# Altium schematic sheet 12_Power.SchDoc: Power (part 1 of 2)
size A3; Organization: Lime Microsystems; Address1: Surrey Tech Centre; Address2: Guildford GU2 7YG; Address3: Surrey; Address4: United Kingdom; Revision: v1.1; SheetNumber: 12; SheetTotal: 12
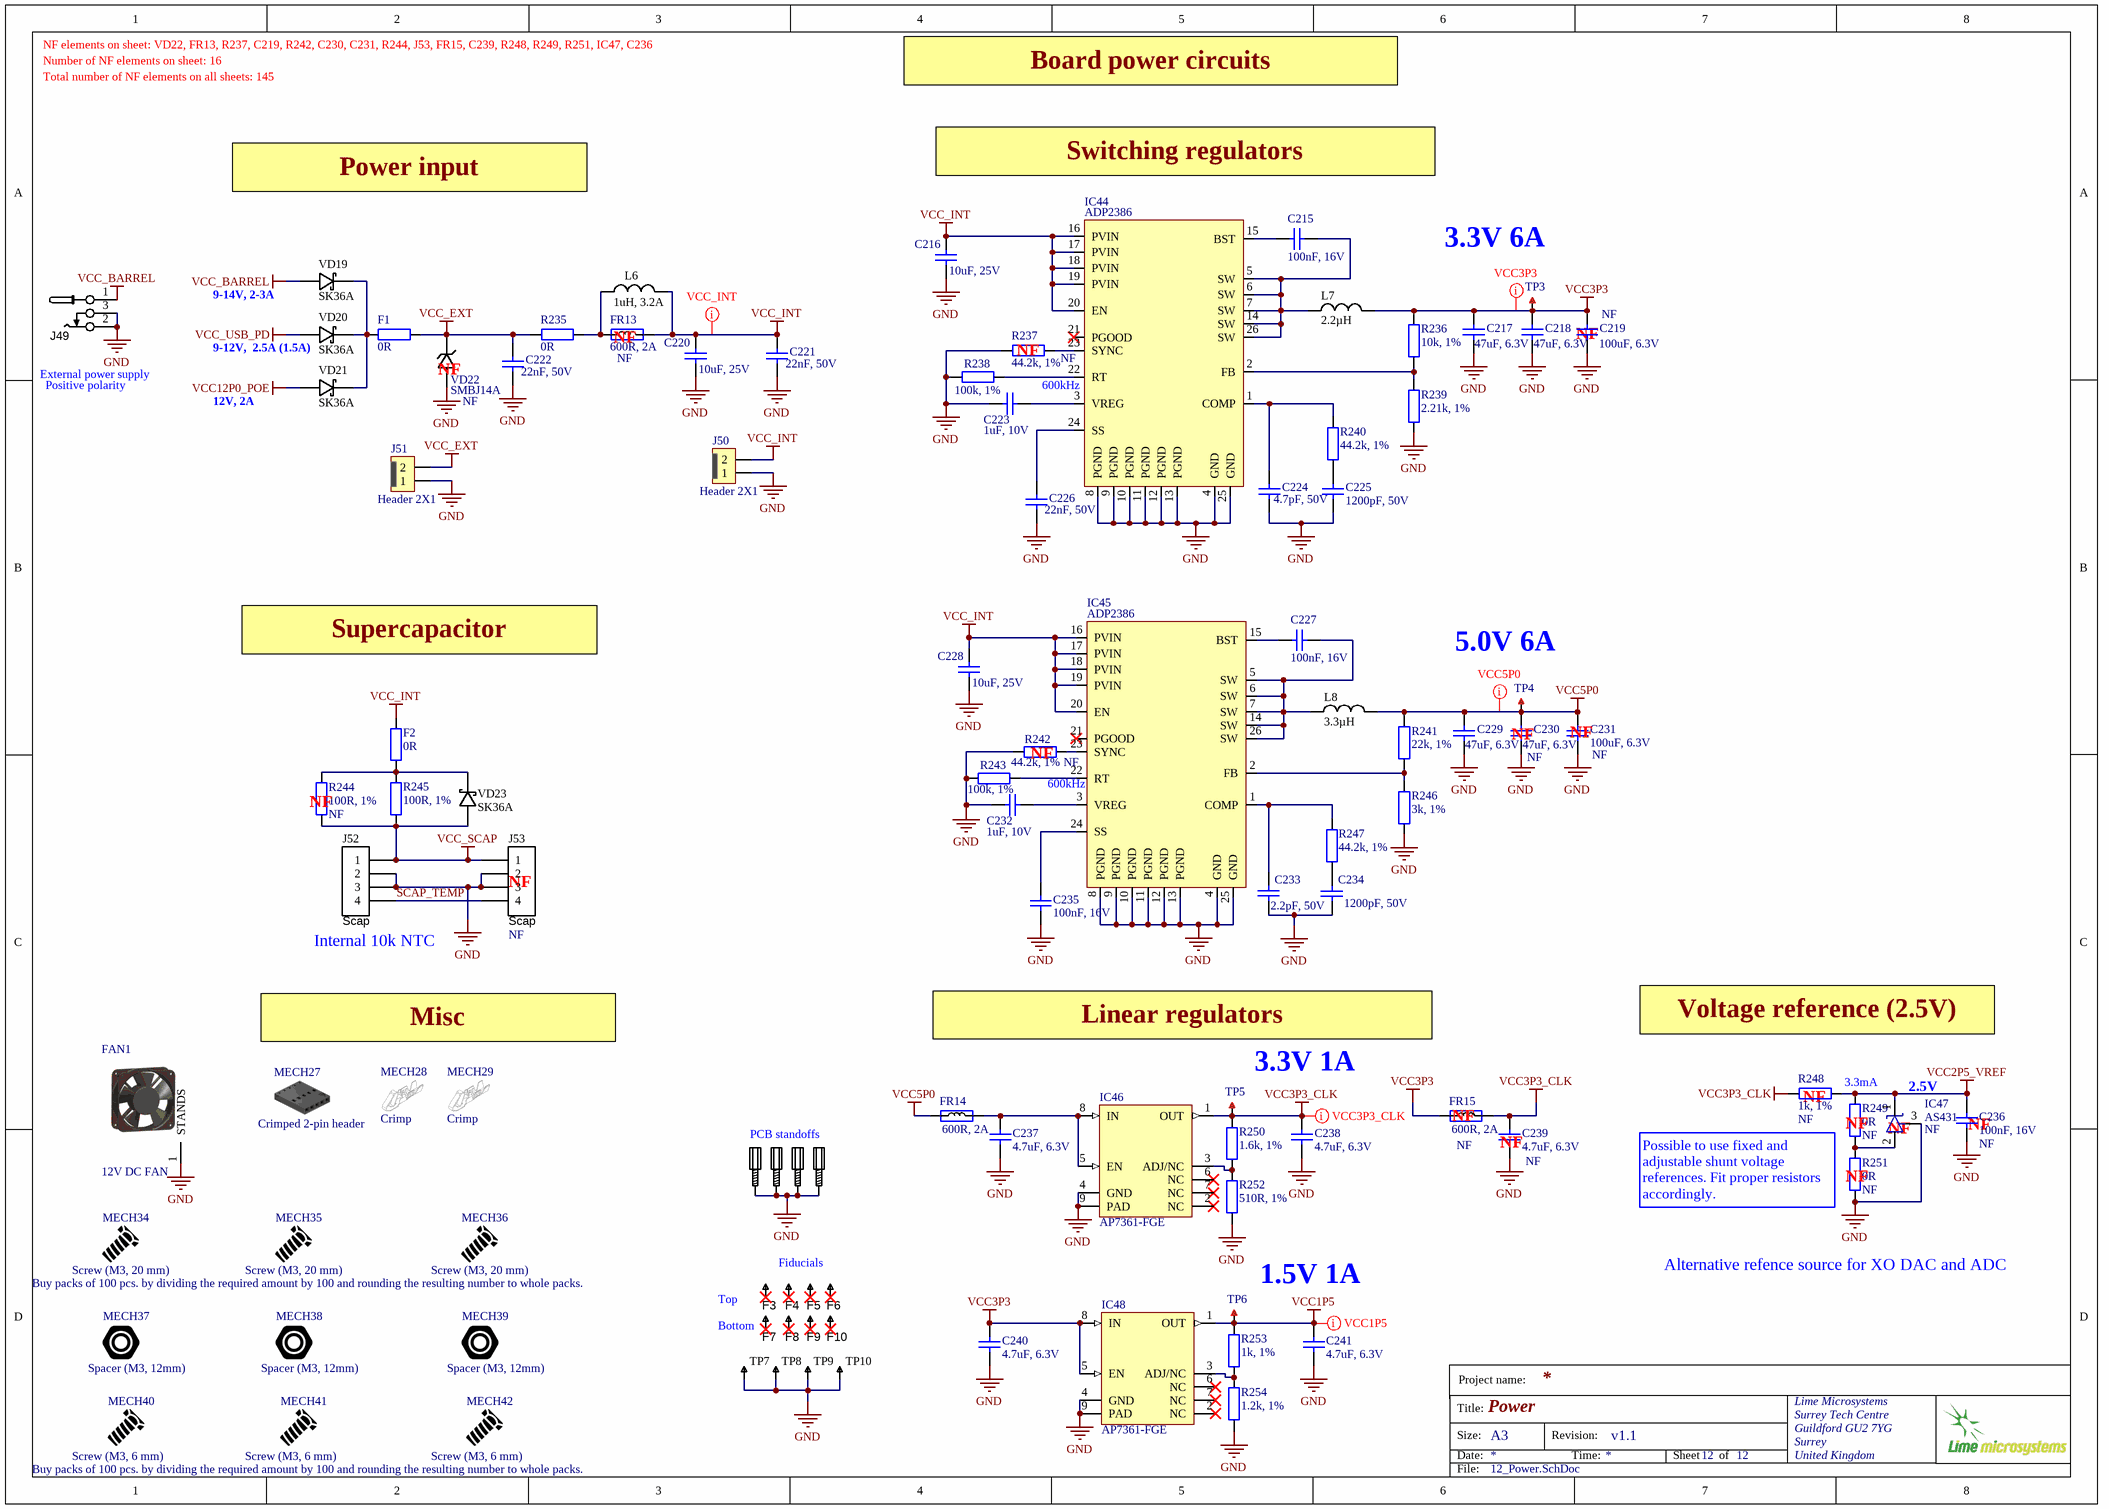
[diagram p0: 12_Power.SchDoc]

## Parts
C215  100nF, 16V  [CAP0402]
C216  10uF, 25V  [CAP0805]
C217  47uF, 6.3V  [CAP1206]
C218  47uF, 6.3V  [CAP1206]
C219  100uF, 6.3V  Assembly Info: NF  [CAP1206]
C220  10uF, 25V  [CAP0805]
C221  22nF, 50V  [CAP0402]
C222  22nF, 50V  [CAP0402]
C223  1uF, 10V  [CAP0402]
C224  4.7pF, 50V  [CAP0402]
C225  1200pF, 50V  [CAP0402]
C226  22nF, 50V  [CAP0402]
C227  100nF, 16V  [CAP0402]
C228  10uF, 25V  [CAP0805]
C229  47uF, 6.3V  [CAP1206]
C230  47uF, 6.3V  Assembly Info: NF  [CAP1206]
C231  100uF, 6.3V  Assembly Info: NF  [CAP1206]
C232  1uF, 10V  [CAP0402]
C233  2.2pF, 50V  [CAP0402]
C234  1200pF, 50V  [CAP0402]
C235  100nF, 16V  [CAP0402]
C236  100nF, 16V  Assembly Info: NF  [CAP0402]
C237  4.7uF, 6.3V  [CAP0402]
C238  4.7uF, 6.3V  [CAP0402]
C239  4.7uF, 6.3V  Assembly Info: NF  [CAP0402]
C240  4.7uF, 6.3V  [CAP0402]
C241  4.7uF, 6.3V  [CAP0402]
F1  0R  [RES0805]
F2  0R  [RES0805]
F3  Fiducial  [Fiducial]  (value not drawn)
F4  Fiducial  [Fiducial]  (value not drawn)
F5  Fiducial  [Fiducial]  (value not drawn)
F6  Fiducial  [Fiducial]  (value not drawn)
F7  Fiducial  [Fiducial]  (value not drawn)
F8  Fiducial  [Fiducial]  (value not drawn)
F9  Fiducial  [Fiducial]  (value not drawn)
F10  Fiducial  [Fiducial]  (value not drawn)
FAN1  12V DC FAN  [FAN_80mm_V1]
FR13  600R, 2A  Assembly Info: NF  [RES0805]
FR14  600R, 2A  [RES0805]
FR15  600R, 2A  Assembly Info: NF  [RES0805]
IC44  ADP2386  [ADP2386]
IC45  ADP2386  [ADP2386]
IC46  AP7361-FGE  [AP7361]
IC47  AS431  Assembly Info: NF  [SOT23-3_v2]
IC48  AP7361-FGE  [AP7361]
J49  CONN_PWR_JACK_2.1x5.5mm  [CONN_PWR_JACK_v2]  (value not drawn)
J50  Header 2X1  [Header1x2_TH_LOCKING]
J51  Header 2X1  [Header1x2_TH_LOCKING]
J52  Scap  [874370443_1P5_SMD_HEADER]
J53  Scap  Assembly Info: NF  [HEADER4X1_TH]
L6  1uH, 3.2A  [NRS4018T3R3MDGJ_inductor]
L7  2.2µH  [FDVE1040_TOKO_INDUCTOR]
L8  3.3µH  [FDVE1040_TOKO_INDUCTOR]
MECH27  Crimped 2-pin header  (mechanical)
MECH28  Crimp  (mechanical)
MECH29  Crimp  (mechanical)
MECH30  # pcs.  [PCB_standoff]  (value not drawn)
MECH31  # pcs.  [PCB_standoff]  (value not drawn)
MECH32  # pcs.  [PCB_standoff]  (value not drawn)
MECH33  # pcs.  [PCB_standoff]  (value not drawn)
MECH34  Screw (M3, 20 mm)  (mechanical)
MECH35  Screw (M3, 20 mm)  Assembly Info: Buy packs of 100 pcs. by dividing the required amount by 100 and rounding the resulting number to whole packs.  (mechanical)
MECH36  Screw (M3, 20 mm)  (mechanical)
MECH37  Spacer (M3, 12mm)  (mechanical)
MECH38  Spacer (M3, 12mm)  (mechanical)
MECH39  Spacer (M3, 12mm)  (mechanical)
MECH40  Screw (M3, 6 mm)  (mechanical)
MECH41  Screw (M3, 6 mm)  Assembly Info: Buy packs of 100 pcs. by dividing the required amount by 100 and rounding the resulting number to whole packs.  (mechanical)
MECH42  Screw (M3, 6 mm)  (mechanical)
R235  0R  [RES0805]
R236  10k, 1%  [RES0402]
R237  44.2k, 1%  Assembly Info: NF  [RES0402]
R238  100k, 1%  [RES0402]
R239  2.21k, 1%  [RES0402]
R240  44.2k, 1%  [RES0402]
R241  22k, 1%  [RES0402]
R242  44.2k, 1%  Assembly Info: NF  [RES0402]
R243  100k, 1%  [RES0402]
R244  100R, 1%  Assembly Info: NF  [RES0805]
R245  100R, 1%  [RES0805]
R246  3k, 1%  [RES0402]
R247  44.2k, 1%  [RES0402]
R248  1k, 1%  Assembly Info: NF  [RES0402]
R249  0R  Assembly Info: NF  [RES0402]
R250  1.6k, 1%  [RES0402]
R251  0R  Assembly Info: NF  [RES0402]
R252  510R, 1%  [RES0402]
R253  1k, 1%  [RES0402]
R254  1.2k, 1%  [RES0402]
TP3  TESTPOINT_PAD  [TP_PAD_1p5MM]  (value not drawn)  (no BOM)
TP4  TESTPOINT_PAD  [TP_PAD_1p5MM]  (value not drawn)  (no BOM)
TP5  TESTPOINT_PAD  [TP_PAD_1p5MM]  (value not drawn)  (no BOM)
TP6  TESTPOINT_PAD  [TP_PAD_1p5MM]  (value not drawn)  (no BOM)
TP7  TESTPOINT_THT_MINI  [TP-SMD-LOW_PROFILE]  (value not drawn)
TP8  TESTPOINT_THT_MINI  [TP-SMD-LOW_PROFILE]  (value not drawn)
TP9  TESTPOINT_THT_MINI  [TP-SMD-LOW_PROFILE]  (value not drawn)
TP10  TESTPOINT_THT_MINI  [TP-SMD-LOW_PROFILE]  (value not drawn)
VD19  SK36A  [SK32A-L_DIODE_DO-214AC]
VD20  SK36A  [SK32A-L_DIODE_DO-214AC]
VD21  SK36A  [SK32A-L_DIODE_DO-214AC]
VD22  SMBJ14A  Assembly Info: NF  [SMAJ12CA-13-F]
VD23  SK36A  [SK32A-L_DIODE_DO-214AC]

## Nets
GND: C216.1 C217.1 C218.1 C219.1 C220.1 C221.2 C222.2 C223.2 C224.2 C225.2 C226.2 C228.1 C229.1 C230.1 C231.1 C232.2 C233.2 C234.2 C235.1 C236.1 C237.1 C238.1 C239.1 C240.1 C241.1 FAN1.1(STANDS) IC44.4(GND) IC44.8(PGND) IC44.9(PGND) IC44.10(PGND) IC44.11(PGND) IC44.12(PGND) IC44.13(PGND) IC44.25(GND) IC45.4(GND) IC45.8(PGND) IC45.9(PGND) IC45.10(PGND) IC45.11(PGND) IC45.12(PGND) IC45.13(PGND) IC45.25(GND) IC46.4(GND) IC46.9(PAD) IC47.3(NC/A) IC48.4(GND) IC48.9(PAD) J49.2 J49.3 J50.1 J51.1 J52.2 J52.3 J53.2 J53.3 MECH30.MH1 MECH31.MH1 MECH32.MH1 MECH33.MH1 R237.2 R238.2 R239.1 R242.2 R243.2 R246.1 R251.2 R252.2 R254.2 TP7.1 TP8.1 TP9.1 TP10.1 VD22.A
VCC1P5: C241.2 IC48.1(OUT) R253.2 TP6.1
VCC2P5_VREF: C236.2 IC47.1(K) R248.1 R249.1
VCC3P3: C217.2 C218.2 C219.2 C240.2 FR15.1 IC48.5(EN) IC48.8(IN) L7.2 R236.1 TP3.1
VCC3P3_CLK: C238.2 C239.2 FR15.2 IC46.1(OUT) R248.2 R250.2 TP5.1
VCC5P0: C229.2 C230.2 C231.2 FR14.1 L8.2 R241.2 TP4.1
VCC12P0_POE: VD21.A
VCC_BARREL: J49.1 VD19.A
VCC_EXT: C222.1 F1.1 J51.2 R235.2 VD22.K
VCC_INT: C216.2 C220.2 C221.1 C228.2 F2.1 FR13.2 IC44.16(PVIN) IC44.17(PVIN) IC44.18(PVIN) IC44.19(PVIN) IC44.20(EN) IC45.16(PVIN) IC45.17(PVIN) IC45.18(PVIN) IC45.19(PVIN) IC45.20(EN) J50.2 L6.2
VCC_SCAP: J52.1 J53.1 R244.2 R245.2 VD23.A
VCC_USB_PD: VD20.A
SCAP_TEMP: J52.4 J53.4
NetC215_1: C215.1 IC44.15(BST)
NetC215_2: C215.2 IC44.5(SW) IC44.6(SW) IC44.7(SW) IC44.14(SW) IC44.26(SW) L7.1
NetC223_1: C223.1 IC44.3(VREG)
NetC224_1: C224.1 IC44.1(COMP) R240.2
NetC225_1: C225.1 R240.1
NetC226_1: C226.1 IC44.24(SS)
NetC227_1: C227.1 IC45.15(BST)
NetC227_2: C227.2 IC45.5(SW) IC45.6(SW) IC45.7(SW) IC45.14(SW) IC45.26(SW) L8.1
NetC232_1: C232.1 IC45.3(VREG)
NetC233_1: C233.1 IC45.1(COMP) R247.2
NetC234_1: C234.1 R247.1
NetC235_2: C235.2 IC45.24(SS)
NetC237_2: C237.2 FR14.2 IC46.5(EN) IC46.8(IN)
NetF1_2: F1.2 VD19.K VD20.K VD21.K
NetF2_2: F2.2 R244.1 R245.1 VD23.K
NetFR13_1: FR13.1 L6.1 R235.1
NetIC44_2: IC44.2(FB) R236.2 R239.2
NetIC44_22: IC44.22(RT) R238.1
NetIC44_23: IC44.23(SYNC) R237.1
NetIC45_2: IC45.2(FB) R241.1 R246.2
NetIC45_22: IC45.22(RT) R243.1
NetIC45_23: IC45.23(SYNC) R242.1
NetIC46_3: IC46.3(ADJ/NC) R250.1 R252.1
NetIC47_2: IC47.2(A) R249.2 R251.1
NetIC48_3: IC48.3(ADJ/NC) R253.1 R254.1

Not connected (* = marked no-connect by the designer): F3 1*; F4 1*; F5 1*; F6 1*; F7 1*; F8 1*; F9 1*; F10 1*; IC44 21(PGOOD)*; IC45 21(PGOOD)*; IC46 2(NC)* 6(NC)* 7(NC)*; IC48 2(NC)* 6(NC)* 7(NC)*

## Layout directives
net class VCC1P5: VCC1P5
net class VCC3P3_CLK: VCC3P3_CLK
net class VCC3P3: VCC3P3
net class VCC_INT: VCC_INT
net class VCC5P0: VCC5P0

## Notes on the sheet
- NF elements on sheet: VD22, FR13, R237, C219, R242, C230, C231, R244, J53, FR15, C239, R248, R249, R251, IC47, C236
- Number of NF elements on sheet: 16
- Total number of NF elements on all sheets: 145
- Board power circuits
- Switching regulators
- Power input
- (near TP3) 3.3V 6A
- 9-14V, 2-3A
- (near J49) External power supply
- (near VD20) 9-12V,  2.5A (1.5A)
- (near VD22) NF
- (near FR13) NF
- (near R237) NF
- (near C219) NF
- (near J49) Positive polarity
- 12V, 2A
- (near IC44) 600kHz
- Supercapacitor
- (near TP4) 5.0V 6A
- (near R242) NF
- (near IC45) 600kHz
- (near C230) NF
- (near C231) NF
- (near R244) NF
- (near J53) NF
- (near J52) Internal 10k NTC
- Misc
- Linear regulators
- Voltage reference (2.5V)
- 3.3V 1A
- (near FR15) NF
- (near R248) NF
- 3.3mA
- 2.5V
- PCB standoffs
- (near C239) NF
- (near R251) NF
- (near R249) NF
- (near IC47) NF
- (near C236) NF
- Possible to use fixed and adjustable shunt voltage references. Fit proper resistors accordingly.
- Top
- (near F7) Bottom
- Fiducials
- 1.5V 1A
- Alternative refence source for XO DAC and ADC
- Project name:
- Title:
- Size:
- Date:
- A3
- Revision:
- Time:
- Sheet
- of
- File: